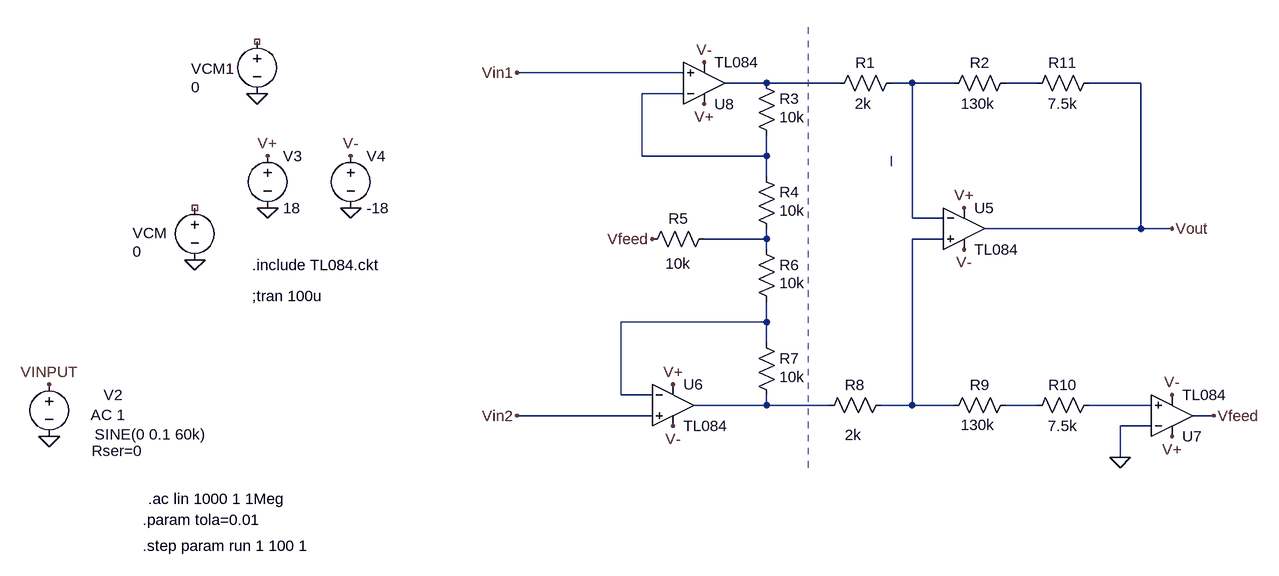
[diagram p0: schematic Draft1ConValores.asc]
Draft1ConValores.asc, the LTspice schematic file:
Version 4
SHEET 1 1008 680
WIRE 48 -160 -208 -160
WIRE 176 -144 112 -144
WIRE 288 -144 176 -144
WIRE 400 -144 368 -144
WIRE 464 -144 400 -144
WIRE 592 -144 544 -144
WIRE 752 -144 672 -144
WIRE 48 -128 -16 -128
WIRE -16 -32 -16 -128
WIRE 176 -32 176 -64
WIRE 176 -32 -16 -32
WIRE 176 0 176 -32
WIRE 400 64 400 -144
WIRE 448 64 400 64
WIRE 752 80 752 -144
WIRE 752 80 512 80
WIRE 800 80 752 80
WIRE 176 96 176 80
WIRE 176 96 80 96
WIRE 448 96 400 96
WIRE 176 112 176 96
WIRE 176 224 176 192
WIRE 176 224 -48 224
WIRE 176 256 176 224
WIRE -48 336 -48 224
WIRE 0 336 -48 336
WIRE 176 352 176 336
WIRE 176 352 64 352
WIRE 272 352 176 352
WIRE 400 352 400 96
WIRE 400 352 352 352
WIRE 464 352 400 352
WIRE 592 352 544 352
WIRE 768 352 672 352
WIRE 0 368 -208 368
WIRE 864 368 832 368
WIRE 768 384 720 384
WIRE 720 432 720 384
FLAG 720 432 0
FLAG 864 368 Vfeed
FLAG 0 96 Vfeed
FLAG -704 128 0
FLAG -608 -128 0
FLAG 800 80 Vout
FLAG -464 48 0
FLAG -592 48 0
FLAG -592 -32 V+
FLAG 80 -112 V+
FLAG 480 48 V+
FLAG 800 400 V+
FLAG 32 320 V+
FLAG -464 -32 V-
FLAG 80 -176 V-
FLAG 480 112 V-
FLAG 800 336 V-
FLAG 32 384 V-
FLAG -208 368 Vin2
FLAG -208 -160 Vin1
FLAG -928 400 0
FLAG -928 320 VINPUT
SYMBOL res 160 -16 R0
WINDOW 3 36 68 Left 2
SYMATTR Value 10k
SYMATTR InstName R4
SYMATTR SpiceLine tol=1
SYMBOL res 160 96 R0
WINDOW 3 36 68 Left 2
SYMATTR Value 10k
SYMATTR InstName R6
SYMATTR SpiceLine tol=1
SYMBOL res 160 240 R0
WINDOW 3 36 68 Left 2
SYMATTR Value 10k
SYMATTR InstName R7
SYMATTR SpiceLine tol=1
SYMBOL res 160 -160 R0
WINDOW 3 36 68 Left 2
SYMATTR Value 10k
SYMATTR InstName R3
SYMATTR SpiceLine tol=1
SYMBOL res 384 -160 R90
WINDOW 0 0 56 VBottom 2
WINDOW 3 63 59 VBottom 2
SYMATTR InstName R1
SYMATTR Value 2k
SYMATTR SpiceLine tol=1
SYMBOL res 560 -160 R90
WINDOW 0 0 56 VBottom 2
WINDOW 3 63 59 VBottom 2
SYMATTR InstName R2
SYMATTR Value 130k
SYMATTR SpiceLine tol=1
SYMBOL res 368 336 R90
WINDOW 0 0 56 VBottom 2
WINDOW 3 77 59 VBottom 2
SYMATTR InstName R8
SYMATTR Value 2k
SYMATTR SpiceLine tol=1
SYMBOL res 96 80 R90
WINDOW 0 0 56 VBottom 2
WINDOW 3 69 56 VBottom 2
SYMATTR InstName R5
SYMATTR Value 10k
SYMATTR SpiceLine tol=1
SYMBOL res 560 336 R90
WINDOW 0 0 56 VBottom 2
WINDOW 3 62 59 VBottom 2
SYMATTR InstName R9
SYMATTR Value 130k
SYMATTR SpiceLine tol=1
SYMBOL voltage -928 304 R0
WINDOW 0 84 32 Left 2
WINDOW 3 70 93 Left 2
WINDOW 123 64 63 Left 2
WINDOW 39 65 118 Left 2
SYMATTR InstName V2
SYMATTR Value SINE(0 0.1 60k)
SYMATTR Value2 AC 1
SYMATTR SpiceLine Rser=0
SYMBOL voltage -608 -224 R0
WINDOW 0 -102 58 Left 2
WINDOW 123 0 0 Left 0
WINDOW 39 0 0 Left 0
WINDOW 3 -102 86 Left 2
SYMATTR InstName VCM1
SYMATTR Value 0
SYMBOL voltage -704 32 R0
WINDOW 0 -96 55 Left 2
WINDOW 123 0 0 Left 0
WINDOW 39 0 0 Left 0
WINDOW 3 -96 83 Left 2
SYMATTR InstName VCM
SYMATTR Value 0
SYMBOL Opamps\\opamp2 480 16 R0
SYMATTR InstName U5
SYMATTR Value TL084
SYMBOL Opamps\\opamp2 32 288 R0
SYMATTR InstName U6
SYMATTR Value TL084
SYMBOL Opamps\\opamp2 800 432 M180
SYMATTR InstName U7
SYMATTR Value TL084
SYMBOL Opamps\\opamp2 80 -80 M180
SYMATTR InstName U8
SYMATTR Value TL084
SYMBOL voltage -592 -48 R0
WINDOW 123 0 0 Left 0
WINDOW 39 0 0 Left 0
SYMATTR InstName V3
SYMATTR Value 18
SYMBOL voltage -464 -48 R0
WINDOW 123 0 0 Left 0
WINDOW 39 0 0 Left 0
SYMATTR InstName V4
SYMATTR Value -18
SYMBOL res 688 336 R90
WINDOW 0 0 56 VBottom 2
WINDOW 3 32 56 VTop 2
SYMATTR InstName R10
SYMATTR Value 7.5k
SYMBOL res 688 -160 R90
WINDOW 0 0 56 VBottom 2
WINDOW 3 32 56 VTop 2
SYMATTR InstName R11
SYMATTR Value 7.5k
TEXT -616 136 Left 2 !.include TL084.ckt
TEXT -616 184 Left 2 !;tran 100u
TEXT -776 496 Left 2 !.ac lin 1000 1 1Meg
TEXT -784 528 Left 2 !.param tola=0.01
TEXT -784 568 Left 2 !.step param run 1 100 1
LINE Normal 240 448 240 -240 1
CIRCLE Normal 368 -16 368 -32 1

The netlist it stands for:
* Draft1ConValores.asc
R4 N004 N005 10k tol=1
R6 N005 N007 10k tol=1
R7 N007 N008 10k tol=1
R3 N001 N004 10k tol=1
R1 N002 N001 2k tol=1
R2 N003 N002 130k tol=1
R8 N006 N008 2k tol=1
R5 N005 Vfeed 10k tol=1
R9 N009 N006 130k tol=1
V2 VINPUT 0 SINE(0 0.1 60k) AC 1 Rser=0
VCM1 NC_01 0 0
VCM NC_02 0 0
XU5 N006 N002 V+ V- Vout TL084  ; pins In+ In- V+ V- OUT
XU6 Vin2 N007 V+ V- N008 TL084  ; pins In+ In- V+ V- OUT
XU7 N010 0 V+ V- Vfeed TL084  ; pins In+ In- V+ V- OUT
XU8 Vin1 N004 V+ V- N001 TL084  ; pins In+ In- V+ V- OUT
V3 V+ 0 18
V4 V- 0 -18
R10 N010 N009 7.5k
R11 Vout N003 7.5k
.include TL084.ckt
;tran 100u
.ac lin 1000 1 1Meg
.param tola=0.01
.step param run 1 100 1
.backanno
.end